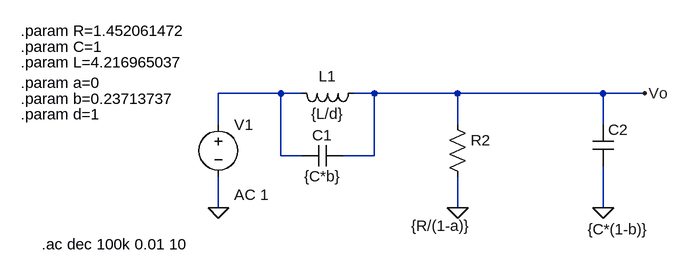
[diagram p0: schematic Ej2a.asc]
Ej2a.asc, the LTspice schematic file:
Version 4
SHEET 1 880 680
WIRE 48 80 -48 80
WIRE 80 80 48 80
WIRE 192 80 160 80
WIRE 320 80 192 80
WIRE 544 80 320 80
WIRE 608 80 544 80
WIRE -48 128 -48 80
WIRE 320 128 320 80
WIRE 544 128 544 80
WIRE 48 176 48 80
WIRE 80 176 48 176
WIRE 192 176 192 80
WIRE 192 176 144 176
WIRE -48 256 -48 208
WIRE 320 256 320 208
WIRE 544 256 544 192
FLAG 320 256 0
FLAG 544 256 0
FLAG -48 256 0
FLAG 608 80 Vo
SYMBOL ind 176 64 R90
WINDOW 0 5 56 VBottom 2
WINDOW 3 32 56 VTop 2
SYMATTR InstName L1
SYMATTR Value {L/d}
SYMBOL cap 144 160 R90
WINDOW 0 0 32 VBottom 2
WINDOW 3 32 32 VTop 2
SYMATTR InstName C1
SYMATTR Value {C*b}
SYMBOL res 304 112 R0
WINDOW 3 -55 172 Left 2
SYMATTR Value {R/(1-a)}
SYMATTR InstName R2
SYMBOL cap 528 128 R0
WINDOW 3 -8 161 Left 2
SYMATTR Value {C*(1-b)}
SYMATTR InstName C2
SYMBOL voltage -48 112 R0
WINDOW 123 24 124 Left 2
WINDOW 39 0 0 Left 0
SYMATTR Value2 AC 1
SYMATTR InstName V1
SYMATTR Value ""
TEXT -352 -16 Left 2 !.param R=1.452061472
TEXT -352 8 Left 2 !.param C=1
TEXT -352 32 Left 2 !.param L=4.216965037
TEXT -352 64 Left 2 !.param a=0
TEXT -352 88 Left 2 !.param b=0.23713737
TEXT -352 112 Left 2 !.param d=1
TEXT -320 312 Left 2 !.ac dec 100k 0.01 10

The netlist it stands for:
* Ej2a.asc
L1 Vo N001 {L/d}
C1 Vo N001 {C*b}
R2 Vo 0 {R/(1-a)}
C2 Vo 0 {C*(1-b)}
V1 N001 0 AC 1
.param R=1.452061472
.param C=1
.param L=4.216965037
.param a=0
.param b=0.23713737
.param d=1
.ac dec 100k 0.01 10
.backanno
.end